# EAGLE schematic old_contorol_board (EAGLE 7.7.0)
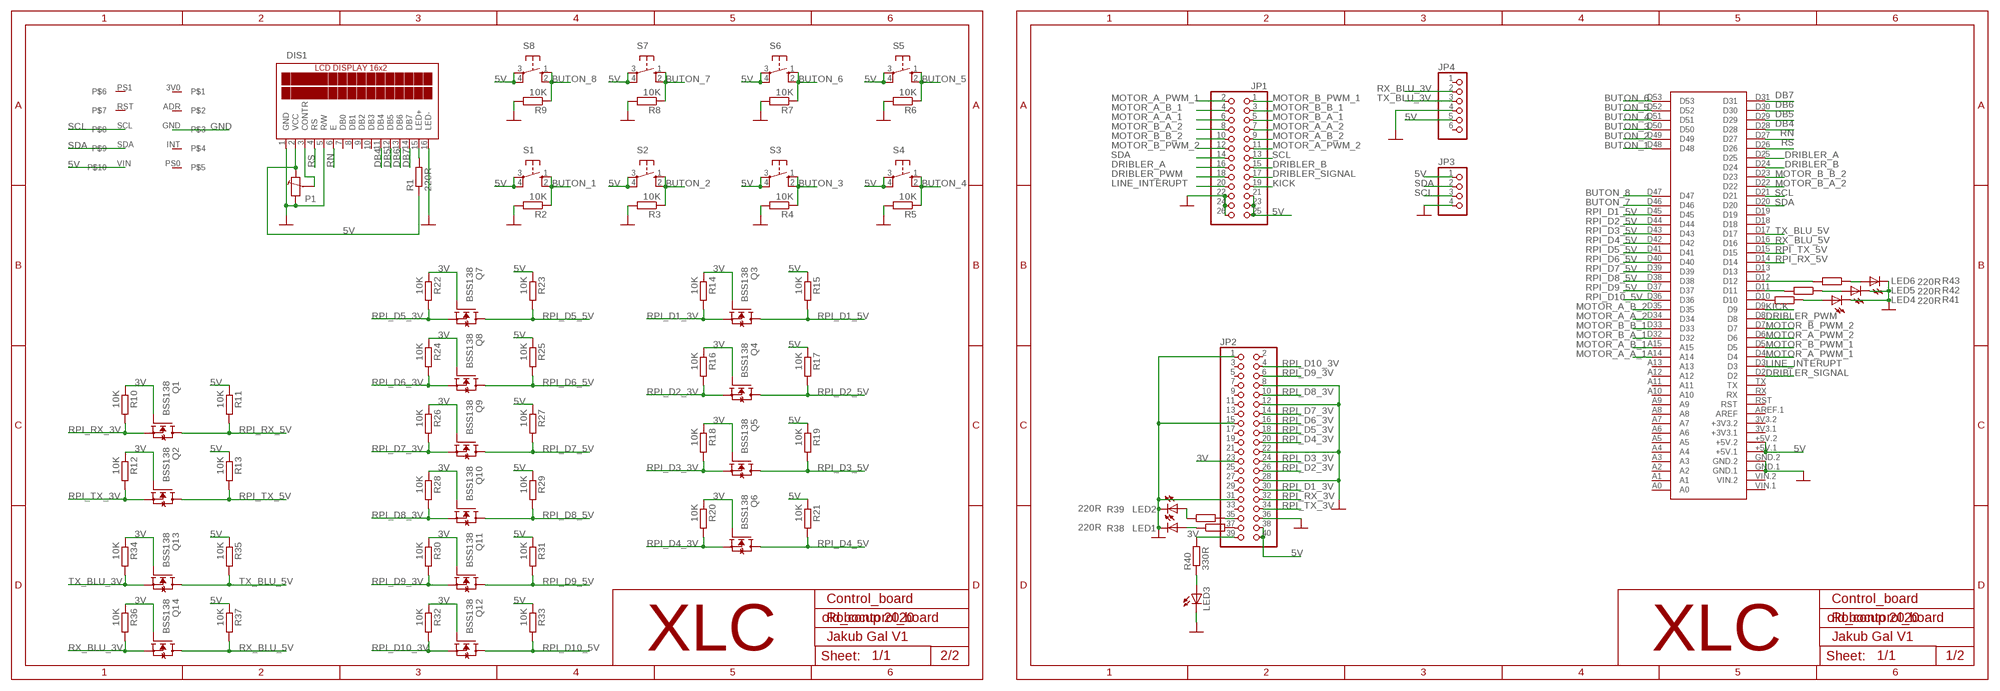
[diagram p0: schematic, sheet 1]

## Parts
DIS1  LCD_DISPLEJ_16X2Z  [LCD_DISPLEJ_16X2]
JP1  PINHD-2X13_2.54  [2X13]
JP2  PINHD-2X20_2.54  [2X20]
JP3  PINHD-1X4_2.54  [1X04]
JP4  PINHD-1X6_2.54  [1X06]
LED1  LEDCHIPLED_0603  [CHIPLED_0603]
LED2  LEDCHIPLED_0603  [CHIPLED_0603]
LED3  LEDCHIPLED_0603  [CHIPLED_0603]
LED4  LEDCHIPLED_0603  [CHIPLED_0603]
LED5  LEDCHIPLED_0603  [CHIPLED_0603]
LED6  LEDCHIPLED_0603  [CHIPLED_0603]
P1  TRIMER-CA6V  [TP-CA6V]
Q1  BSS138  [SOT23]
Q2  BSS138  [SOT23]
Q3  BSS138  [SOT23]
Q4  BSS138  [SOT23]
Q5  BSS138  [SOT23]
Q6  BSS138  [SOT23]
Q7  BSS138  [SOT23]
Q8  BSS138  [SOT23]
Q9  BSS138  [SOT23]
Q10  BSS138  [SOT23]
Q11  BSS138  [SOT23]
Q12  BSS138  [SOT23]
Q13  BSS138  [SOT23]
Q14  BSS138  [SOT23]
R1  220R  R-EU_R0603  [R0603]
R2  10K  R-EU_R0603  [R0603]
R3  10K  R-EU_R0603  [R0603]
R4  10K  R-EU_R0603  [R0603]
R5  10K  R-EU_R0603  [R0603]
R6  10K  R-EU_R0603  [R0603]
R7  10K  R-EU_R0603  [R0603]
R8  10K  R-EU_R0603  [R0603]
R9  10K  R-EU_R0603  [R0603]
R10  10K  R-EU_R0603  [R0603]
R11  10K  R-EU_R0603  [R0603]
R12  10K  R-EU_R0603  [R0603]
R13  10K  R-EU_R0603  [R0603]
R14  10K  R-EU_R0603  [R0603]
R15  10K  R-EU_R0603  [R0603]
R16  10K  R-EU_R0603  [R0603]
R17  10K  R-EU_R0603  [R0603]
R18  10K  R-EU_R0603  [R0603]
R19  10K  R-EU_R0603  [R0603]
R20  10K  R-EU_R0603  [R0603]
R21  10K  R-EU_R0603  [R0603]
R22  10K  R-EU_R0603  [R0603]
R23  10K  R-EU_R0603  [R0603]
R24  10K  R-EU_R0603  [R0603]
R25  10K  R-EU_R0603  [R0603]
R26  10K  R-EU_R0603  [R0603]
R27  10K  R-EU_R0603  [R0603]
R28  10K  R-EU_R0603  [R0603]
R29  10K  R-EU_R0603  [R0603]
R30  10K  R-EU_R0603  [R0603]
R31  10K  R-EU_R0603  [R0603]
R32  10K  R-EU_R0603  [R0603]
R33  10K  R-EU_R0603  [R0603]
R34  10K  R-EU_R0603  [R0603]
R35  10K  R-EU_R0603  [R0603]
R36  10K  R-EU_R0603  [R0603]
R37  10K  R-EU_R0603  [R0603]
R38  220R  R-EU_R0603  [R0603]
R39  220R  R-EU_R0603  [R0603]
R40  330R  R-EU_R0603  [R0603]
R41  220R  R-EU_R0603  [R0603]
R42  220R  R-EU_R0603  [R0603]
R43  220R  R-EU_R0603  [R0603]
S1  10-XX  [B3F-10XX]
S2  10-XX  [B3F-10XX]
S3  10-XX  [B3F-10XX]
S4  10-XX  [B3F-10XX]
S5  10-XX  [B3F-10XX]
S6  10-XX  [B3F-10XX]
S7  10-XX  [B3F-10XX]
S8  10-XX  [B3F-10XX]
U$1  MEGA2560_MIKRO  [MEGA2560_MIKRO]
U$2  BNO055  [BNO005]

## Nets
3V: JP2.23 JP2.39 Q1.1(G) Q2.1(G) Q3.1(G) Q4.1(G) Q5.1(G) Q6.1(G) Q7.1(G) Q8.1(G) Q9.1(G) Q10.1(G) Q11.1(G) Q12.1(G) Q13.1(G) Q14.1(G) R10.1 R12.1 R14.1 R16.1 R18.1 R20.1 R22.1 R24.1 R26.1 R28.1 R30.1 R32.1 R34.1 R36.1 R40.2
5V: DIS1.2(VCC) JP1.21 JP1.23 JP1.25 JP2.38 JP2.40 JP3.1 JP4.5 P1.2 R1.1 R11.1 R13.1 R15.1 R17.1 R19.1 R21.1 R23.1 R25.1 R27.1 R29.1 R31.1 R33.1 R35.1 R37.1 S1.3(P) S1.4(P1) S2.3(P) S2.4(P1) S3.3(P) S3.4(P1) S4.3(P) S4.4(P1) S5.3(P) S5.4(P1) S6.3(P) S6.4(P1) S7.3(P) S7.4(P1) S8.3(P) S8.4(P1) U$1.+5V.1 U$1.+5V.2 U$2.VIN
BUTON_1: R2.1 S1.1(S) S1.2(S1) U$1.D48
BUTON_2: R3.1 S2.1(S) S2.2(S1) U$1.D49
BUTON_3: R4.1 S3.1(S) S3.2(S1) U$1.D50
BUTON_4: R5.1 S4.1(S) S4.2(S1) U$1.D51
BUTON_5: R6.1 S5.1(S) S5.2(S1) U$1.D52
BUTON_6: R7.1 S6.1(S) S6.2(S1) U$1.D53
BUTON_7: R8.1 S7.1(S) S7.2(S1) U$1.D46
BUTON_8: R9.1 S8.1(S) S8.2(S1) U$1.D47
DB4: DIS1.11(DB4) U$1.D28
DB5: DIS1.12(DB5) U$1.D29
DB6: DIS1.13(DB6) U$1.D30
DB7: DIS1.14(DB7) U$1.D31
DRIBLER_A: JP1.16 U$1.D25
DRIBLER_B: JP1.15 U$1.D24
DRIBLER_PWM: JP1.18 U$1.D8
DRIBLER_SIGNAL: JP1.17 U$1.D2
GND: DIS1.1(GND) DIS1.5(R/W) DIS1.16(LED-) JP1.22 JP1.24 JP1.26 JP2.1 JP2.8 JP2.12 JP2.15 JP2.22 JP2.28 JP2.31 JP2.36 JP3.4 JP4.4 LED1.C LED2.C LED3.C LED4.C LED5.C LED6.C P1.1 R2.2 R3.2 R4.2 R5.2 R6.2 R7.2 R8.2 R9.2 U$1.GND.1 U$1.GND.2 U$2.GND
KICK: JP1.19 U$1.D9
LINE_INTERUPT: JP1.20 U$1.D3
MOTOR_A_A_1: JP1.6 U$1.A14
MOTOR_A_A_2: JP1.7 U$1.D34
MOTOR_A_B_1: JP1.4 U$1.A15
MOTOR_A_B_2: JP1.9 U$1.D35
MOTOR_A_PWM_1: JP1.2 U$1.D4
MOTOR_A_PWM_2: JP1.11 U$1.D6
MOTOR_B_A_1: JP1.5 U$1.D32
MOTOR_B_A_2: JP1.8 U$1.D22
MOTOR_B_B_1: JP1.3 U$1.D33
MOTOR_B_B_2: JP1.10 U$1.D23
MOTOR_B_PWM_1: JP1.1 U$1.D5
MOTOR_B_PWM_2: JP1.12 U$1.D7
N$1: JP2.37 R38.2
N$2: DIS1.15(LED+) R1.2
N$3: DIS1.3(CONTR) P1.BEZ
N$4: LED2.A R39.1
N$5: JP2.35 R39.2
N$6: LED3.A R40.1
N$7: LED4.A R41.1
N$8: R41.2 U$1.D10
N$9: LED5.A R42.1
N$10: R42.2 U$1.D11
N$11: LED6.A R43.1
N$12: R43.2 U$1.D12
N$20: LED1.A R38.1
RN: DIS1.6(E) U$1.D27
RPI_D1_3V: JP2.30 Q3.2(S) R14.2
RPI_D1_5V: Q3.3(D) R15.2 U$1.D45
RPI_D2_3V: JP2.26 Q4.2(S) R16.2
RPI_D2_5V: Q4.3(D) R17.2 U$1.D44
RPI_D3_3V: JP2.24 Q5.2(S) R18.2
RPI_D3_5V: Q5.3(D) R19.2 U$1.D43
RPI_D4_3V: JP2.20 Q6.2(S) R20.2
RPI_D4_5V: Q6.3(D) R21.2 U$1.D42
RPI_D5_3V: JP2.18 Q7.2(S) R22.2
RPI_D5_5V: Q7.3(D) R23.2 U$1.D41
RPI_D6_3V: JP2.16 Q8.2(S) R24.2
RPI_D6_5V: Q8.3(D) R25.2 U$1.D40
RPI_D7_3V: JP2.14 Q9.2(S) R26.2
RPI_D7_5V: Q9.3(D) R27.2 U$1.D39
RPI_D8_3V: JP2.10 Q10.2(S) R28.2
RPI_D8_5V: Q10.3(D) R29.2 U$1.D38
RPI_D9_3V: JP2.6 Q11.2(S) R30.2
RPI_D9_5V: Q11.3(D) R31.2 U$1.D37
RPI_D10_3V: JP2.4 Q12.2(S) R32.2
RPI_D10_5V: Q12.3(D) R33.2 U$1.D36
RPI_RX_3V: JP2.32 Q1.2(S) R10.2
RPI_RX_5V: Q1.3(D) R11.2 U$1.D14
RPI_TX_3V: JP2.34 Q2.2(S) R12.2
RPI_TX_5V: Q2.3(D) R13.2 U$1.D15
RS: DIS1.4(RS) U$1.D26
RX_BLU_3V: JP4.2 Q14.2(S) R36.2
RX_BLU_5V: Q14.3(D) R37.2 U$1.D16
SCL: JP1.13 JP3.3 U$1.D21 U$2.SCL
SDA: JP1.14 JP3.2 U$1.D20 U$2.SDA
TX_BLU_3V: JP4.3 Q13.2(S) R34.2
TX_BLU_5V: Q13.3(D) R35.2 U$1.D17
Unconnected: DIS1.7(DB0) DIS1.8(DB1) DIS1.9(DB2) DIS1.10(DB3) JP2.2 JP2.3 JP2.5 JP2.7 JP2.9 JP2.11 JP2.13 JP2.17 JP2.19 JP2.21 JP2.25 JP2.27 JP2.29 JP2.33 JP4.1 JP4.6 U$1.3V3.1(+3V3.1) U$1.3V3.2(+3V3.2) U$1.A0 U$1.A1 U$1.A2 U$1.A3 U$1.A4 U$1.A5 U$1.A6 U$1.A7 U$1.A8 U$1.A9 U$1.A10 U$1.A11 U$1.A12 U$1.A13 U$1.AREF.1(AREF) U$1.D13 U$1.D18 U$1.D19 U$1.RST U$1.RX U$1.TX U$1.VIN.1 U$1.VIN.2 U$2.3V0 U$2.ADR U$2.INT U$2.PS0 U$2.PS1 U$2.RST

## Notes on the sheet
- Control_board | Control_board
- Robocup 2020 | Robocup 2020
- Jakub Gal V1 | Jakub Gal V1
- XLC | XLC
- 2/2 | 1/2

## Library data of the parts
DIS1 = TABOR K1:LCD_DISPLEJ_16X2: LCD displej 16x2 s IO HD44870 : kolik= 0,6x0,6mm diera s pokovenim = 0,9mm vrtanie = 1,1mm
JP1 = pinhead-1:PINHD-2X13: PIN HEADER
JP2 = pinhead-1:PINHD-2X20: PIN HEADER
JP3 = pinhead-1:PINHD-1X4: PIN HEADER
JP4 = pinhead-1:PINHD-1X6: PIN HEADER
LED1-LED6 = audio amplifier example:LED
P1 = TABOR K1:TRIMER: Trimer
Q1-Q14 = bss138_10:BSS138: BSS138 N-Channel Logic Level Enhancement Mode Field Effect Transistor Source: http://www.fairchildsemi.com/datasheets/BS/BSS138.pdf; MF: Fairchild; MPN: BSS138; OC_FARNELL: 9845330; OC_NEWARK: 67R2009
R1-R43 = rcl:R-EU_: RESISTOR, European symbol; SPICEPREFIX: R
S1-S8 = switch-omron:10-XX: OMRON SWITCH; MPN: B3F-1000; OC_FARNELL: 176432; OC_NEWARK: 36M3542
U$1 = MIKRO_MEGA2560:MEGA2560_MIKRO: Arduino Mega2560 pro robotDyn, create by mikroavr.com
U$2 = SERVO:BNO055